# Altium schematic sheet Interface_CAN.SchDoc
size Legal; SPICEModelCacheOQIDUCOR: <root> / <DocumentId>OQIDUCOR</DocumentId> / </root>
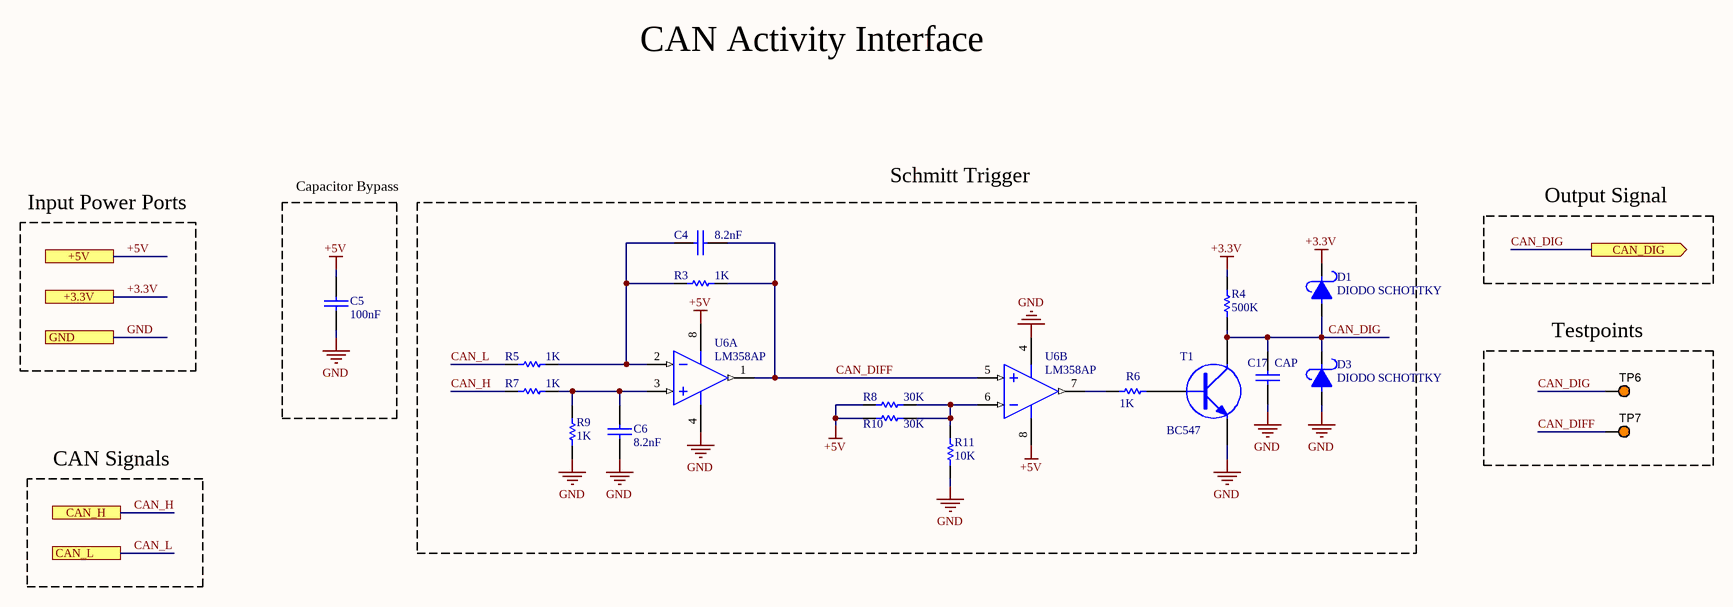
[diagram p0: Interface_CAN.SchDoc]

## Parts
C4  8.2nF  [CAP200]
C5  100nF  [CAP200]
C6  8.2nF  [CAP200]
C17  CAP  [CAP200]
D1  DIODO SCHOTTKY  [DO41]
D3  DIODO SCHOTTKY  [DO41]
R3  1K  [RES400]
R4  500K  [RES400]
R5  1K  [RES400]
R6  1K  [RES400]
R7  1K  [RES400]
R8  30K  [RES400]
R9  1K  [RES400]
R10  30K  [RES400]
R11  10K  [RES400]
T1  BC547  [TO92]
TP6  5003  [KSTN-5003]  (value not drawn)
TP7  5003  [KSTN-5003]  (value not drawn)
U6  LM358AP  [P0008A]  (parts A,B of 2)

## Blocks framed on the sheet
Capacitor Bypass: C5
Schmitt Trigger: C4 C6 C17 D1 D3 R3-R11 T1 U6
Testpoints: TP6 TP7

## Ports
+3.3V, +5V, CAN_DIG (out), CAN_H, CAN_L, GND

## Nets
+3.3V: D1.2 R4.2 ; port +3.3V
+5V: C5.1 R8.1 R10.1 U6.8(VCC) ; port +5V
GND: C5.2 C6.2 C17.2 D3.1 R9.1 R11.1 T1.3(E) U6.4(GND) ; port GND
CAN_DIFF: C4.2 R3.1 TP7.1 U6.1(1OUT) U6.5(2IN+)
CAN_DIG: C17.1 D1.1 D3.2 R4.1 T1.2(C) TP6.1 ; port CAN_DIG
CAN_H: R7.1 ; port CAN_H
CAN_L: R5.1 ; port CAN_L
NetC4_1: C4.1 R3.2 R5.2 U6.2(1IN-)
NetC6_1: C6.1 R7.2 R9.2 U6.3(1IN+)
NetR6_1: R6.1 U6.7(2OUT)
NetR6_2: R6.2 T1.1(B)
NetR8_2: R8.2 R10.2 R11.2 U6.6(2IN-)

## Notes on the sheet
- CAN Activity Interface
- Input Power Ports
- Output Signal
- CAN Signals

## Library data of the parts
C4-C6 = CAP
R3-R11 = CMP-009-00195-1: Component Type: Standard; Source: Schematics.SchLib; Pins: 2; Design Item ID: RES
T1 = CMP-012-00019-1: Component Type: Standard; Source: Schematics.SchLib; Design Item ID: TRANSISTOR NPN; Pins: 3
TP6 TP7 = CMP-002-00037-2: Test Point, Orange, Height 4.6 mm, Tail Length 3 mm, 1-Pin THD, RoHS; Manufacturer: Keystone; Colour: Orange; Packaging: Bulk; Package Description: 1-Pin Through Hole Device, Dia 2.54 mm; Pins: 1; Package Reference: 5003; Datasheet Version: Jun-15; Case/Package: 5003; Mounting Technology: TH; Connector Type: TestPoint; Diameter: 2.54mm; Contact Material: Bronze; Datasheet URL: http://keyelco.com/userAssets/file/M65p56.pdf; Manufacturer URL: http://www.keyelco.com/; Package Quantity: 10; Contact Plating: Tin; RoHS Compliant: True
U6 = CMP-014-00023-2: Dual Operational Amplifier, 3 to 32 V, 0 to 70 degC, 8-Pin PDIP (P), Pb-Free (RoHS), Tube; Manufacturer: Texas Instruments (TI); Channels: 2; Max Dual Supply Voltage: 16V; Min Dual Supply Voltage: 1.5V; Slew Rate: 0.3V/us; Unity Gain Bandwidth Product: 700KHz; Common Mode Rejection Ratio: 65dB; Nominal Supply Voltage: 5V; Package Version: 4040082/E, 04/2010; Output Current: 30mA; Nominal Supply Current: 1.2mA; Nominal Voltage Gain: 100dB; Case/Package: DIP; Max Operating Temperature: 70°C; RoHS Compliant: True; Manufacturer URL: http://www.ti.com/; Pins: 8; Package Description: 8-Pin Double In-line Package, Body 9.59 x 6.35 mm, Pitch 2.54 mm; Datasheet URL: http://www.ti.com/lit/ds/symlink/lm358a.pdf; Max Supply Voltage: 16V; Package Reference: P0008A; Mounting Technology: TH; Min Operating Temperature: 0°C; Package URL: http://www.ti.com/lit/ml/mpdi001b/mpdi001b.pdf; Min Supply Voltage: 1.5V; Package Quantity: 50; Packaging: Rail/Tube; Datasheet Version: SLOS068T, 04/2015; Nominal Gain Bandwith Product: 700KHz